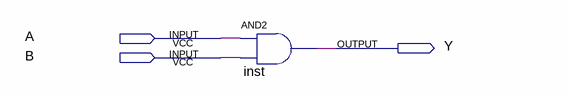
[diagram p0: schematic sheet]
// Quartus schematic and_gate.bdf as structural Verilog: 1 symbols, 3 pins
module and_gate (
  input  A,
  input  B,
  output Y
);

  and inst (Y, A, B);
endmodule
